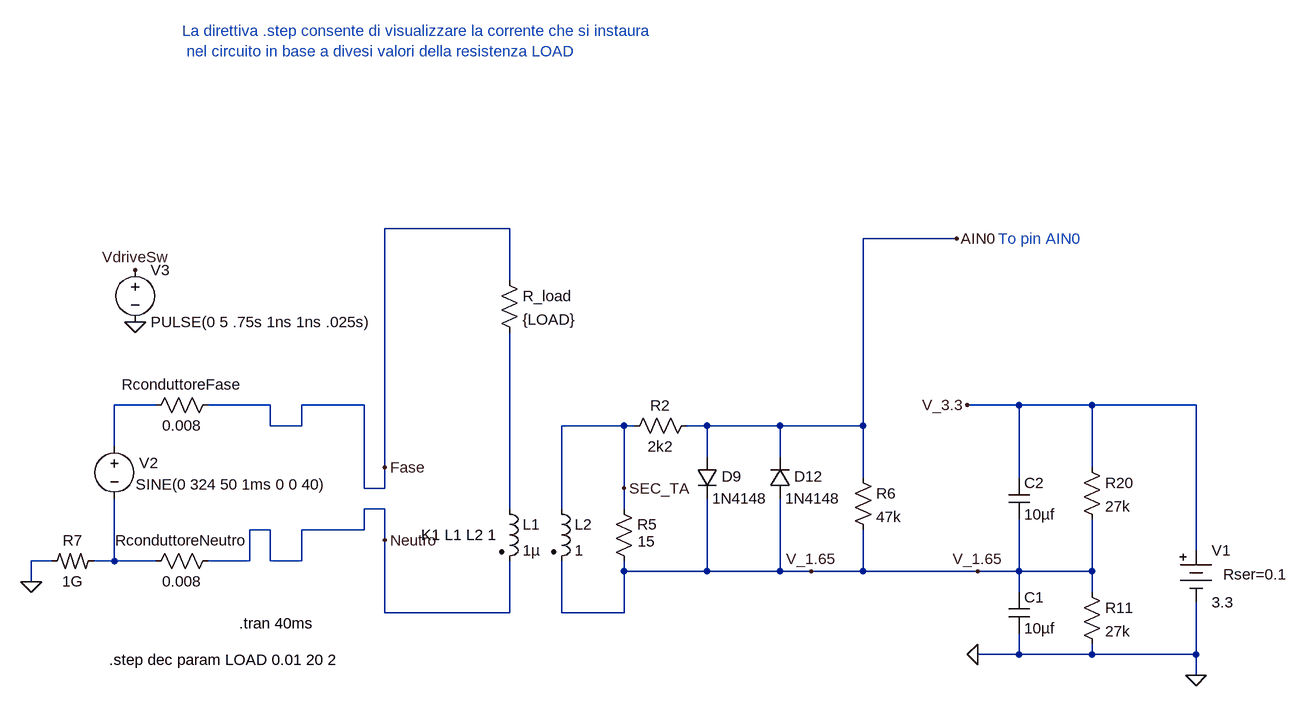
[diagram p0: schematic TrasfCurrentStudio2.asc]
TrasfCurrentStudio2.asc, the LTspice schematic file:
Version 4
SHEET 1 2288 680
WIRE 528 -464 336 -464
WIRE 1216 -448 1072 -448
WIRE 528 -384 528 -464
WIRE -16 -192 -80 -192
WIRE 160 -192 64 -192
WIRE 304 -192 208 -192
WIRE 1312 -192 1232 -192
WIRE 1424 -192 1312 -192
WIRE 1584 -192 1424 -192
WIRE 160 -160 160 -192
WIRE 208 -160 208 -192
WIRE 208 -160 160 -160
WIRE 704 -160 608 -160
WIRE 720 -160 704 -160
WIRE 832 -160 800 -160
WIRE 944 -160 832 -160
WIRE 1072 -160 1072 -448
WIRE 1072 -160 944 -160
WIRE -80 -128 -80 -192
WIRE 832 -112 832 -160
WIRE 944 -112 944 -160
WIRE 336 -96 336 -464
WIRE 1424 -96 1424 -192
WIRE 1072 -80 1072 -160
WIRE 1312 -80 1312 -192
WIRE 304 -64 304 -192
WIRE 336 -64 336 -96
WIRE 336 -64 304 -64
WIRE 704 -64 704 -160
WIRE 336 -32 304 -32
WIRE 528 -32 528 -304
WIRE 608 -32 608 -160
WIRE 704 -32 704 -64
WIRE 160 0 128 0
WIRE 304 0 304 -32
WIRE 304 0 208 0
WIRE 336 16 336 -32
WIRE 1584 32 1584 -192
WIRE -176 48 -208 48
WIRE -80 48 -80 -48
WIRE -80 48 -112 48
WIRE -16 48 -80 48
WIRE 128 48 128 0
WIRE 128 48 64 48
WIRE 160 48 160 0
WIRE 208 48 208 0
WIRE 208 48 160 48
WIRE 704 64 704 48
WIRE 832 64 832 -48
WIRE 832 64 704 64
WIRE 944 64 944 -48
WIRE 944 64 832 64
WIRE 992 64 944 64
WIRE 1072 64 1072 0
WIRE 1072 64 992 64
WIRE 1248 64 1072 64
WIRE 1312 64 1312 -16
WIRE 1312 64 1248 64
WIRE 1424 64 1424 -16
WIRE 1424 64 1312 64
WIRE -208 80 -208 48
WIRE 1312 96 1312 64
WIRE 1424 96 1424 64
WIRE 336 128 336 16
WIRE 528 128 528 48
WIRE 528 128 336 128
WIRE 608 128 608 48
WIRE 704 128 704 64
WIRE 704 128 608 128
WIRE 1312 192 1312 160
WIRE 1312 192 1248 192
WIRE 1424 192 1424 176
WIRE 1424 192 1312 192
WIRE 1584 192 1584 112
WIRE 1584 192 1424 192
WIRE 1584 224 1584 192
FLAG 1232 -192 V_3.3
FLAG -208 80 0
FLAG 1584 224 0
FLAG 1216 -448 AIN0
FLAG 1248 64 V_1.65
FLAG 992 64 V_1.65
FLAG 1248 192 0
FLAG -48 -400 VdriveSw
FLAG -48 -320 0
FLAG 336 -96 Fase
FLAG 336 16 Neutro
FLAG 704 -64 SEC_TA
SYMBOL battery 1584 16 R0
WINDOW 123 0 0 Left 0
WINDOW 39 42 53 Left 2
SYMATTR SpiceLine Rser=0.1
SYMATTR InstName V1
SYMATTR Value 3.3
SYMBOL res 688 -48 R0
WINDOW 3 37 66 Left 2
SYMATTR Value 15
SYMATTR InstName R5
SYMBOL ind2 512 -48 R0
SYMATTR InstName L1
SYMATTR Value 1µ
SYMATTR Type ind
SYMATTR SpiceLine Rser=1u
SYMBOL ind2 592 -48 R0
SYMATTR InstName L2
SYMATTR Value 1
SYMATTR Type ind
SYMATTR SpiceLine Rser=47 Cpar=1pF
SYMBOL res2 -112 32 R90
WINDOW 0 0 32 VBottom 2
WINDOW 3 32 32 VTop 2
SYMATTR InstName R7
SYMATTR Value 1G
SYMBOL res 1408 -112 R0
SYMATTR InstName R20
SYMATTR Value 27k
SYMBOL cap 1296 96 R0
SYMATTR InstName C1
SYMATTR Value 10µf
SYMBOL res 816 -176 R90
WINDOW 0 0 56 VBottom 2
WINDOW 3 32 56 VTop 2
SYMATTR InstName R2
SYMATTR Value 2k2
SYMBOL diode 816 -112 R0
WINDOW 0 38 30 Left 2
SYMATTR InstName D9
SYMATTR Value 1N4148
SYMBOL diode 928 -48 M180
WINDOW 0 38 34 Left 2
WINDOW 3 24 0 Left 2
SYMATTR InstName D12
SYMATTR Value 1N4148
SYMBOL res 1408 80 R0
SYMATTR InstName R11
SYMATTR Value 27k
SYMBOL voltage -80 -144 R0
WINDOW 123 0 0 Left 0
WINDOW 0 38 41 Left 2
WINDOW 3 33 74 Left 2
SYMATTR InstName V2
SYMATTR Value SINE(0 324 50 1ms 0 0 40)
SYMATTR SpiceLine Rser=0.01 Cpar=10nF
SYMBOL voltage -48 -416 R0
WINDOW 123 0 0 Left 0
WINDOW 39 0 0 Left 0
SYMATTR InstName V3
SYMATTR Value PULSE(0 5 .75s 1ns 1ns .025s)
SYMBOL res 80 -208 R90
WINDOW 0 0 56 VBottom 2
WINDOW 3 32 56 VTop 2
SYMATTR InstName RconduttoreFase
SYMATTR Value 0.008
SYMBOL res 80 32 R90
WINDOW 0 0 56 VBottom 2
WINDOW 3 32 56 VTop 2
SYMATTR InstName RconduttoreNeutro
SYMATTR Value 0.008
SYMBOL cap 1296 -80 R0
SYMATTR InstName C2
SYMATTR Value 10µf
SYMBOL res 512 -400 R0
SYMATTR InstName R_load
SYMATTR Value {LOAD}
SYMBOL res 1056 -96 R0
SYMATTR InstName R6
SYMATTR Value 47k
TEXT 112 144 Left 2 !.tran 40ms
TEXT 392 8 Left 2 !K1 L1 L2 1
TEXT -88 200 Left 2 !.step dec param LOAD 0.01 20 2
TEXT 1280 -448 Left 2 ;To pin AIN0
TEXT 24 -768 Left 2 ;La direttiva .step consente di visualizzare la corrente che si instaura\n nel circuito in base a divesi valori della resistenza LOAD

The netlist it stands for:
* TrasfCurrentStudio2.asc
V1 V_3.3 0 3.3 Rser=0.1
R5 SEC_TA V_1.65 15
L1 N002 Neutro 1µ Rser=1u
L2 SEC_TA V_1.65 1 Rser=47 Cpar=1pF
R7 N003 0 1G
R20 V_3.3 V_1.65 27k
C1 V_1.65 0 10µf
R2 AIN0 SEC_TA 2k2
D9 AIN0 V_1.65 1N4148
D12 V_1.65 AIN0 1N4148
R11 V_1.65 0 27k
V2 N001 N003 SINE(0 324 50 1ms 0 0 40) Rser=0.01 Cpar=10nF
V3 VdriveSw 0 PULSE(0 5 .75s 1ns 1ns .025s)
RconduttoreFase Fase N001 0.008
RconduttoreNeutro Neutro N003 0.008
C2 V_3.3 V_1.65 10µf
R_load Fase N002 {LOAD}
R6 AIN0 V_1.65 47k
.model D D
.lib standard.dio
.tran 40ms
K1 L1 L2 1
.step dec param LOAD 0.01 20 2
* To pin AIN0
* La direttiva .step consente di visualizzare la corrente che si instaura
*  nel circuito in base a divesi valori della resistenza LOAD
.backanno
.end

* Results of the author's LTspice run, read from the files saved beside the schematic
* Operating Point (first step), zero values left out:
*   load = 10 m
*   V(v_3.3) = 3.3 V
*   V(sec_ta) = 1.65 V
*   V(v_1.65) = 1.65 V
*   V(ain0) = 1.65 V
*   I(R11) = 61.11 µA
*   I(R20) = 61.11 µA
*   I(V1) = -61.11 µA
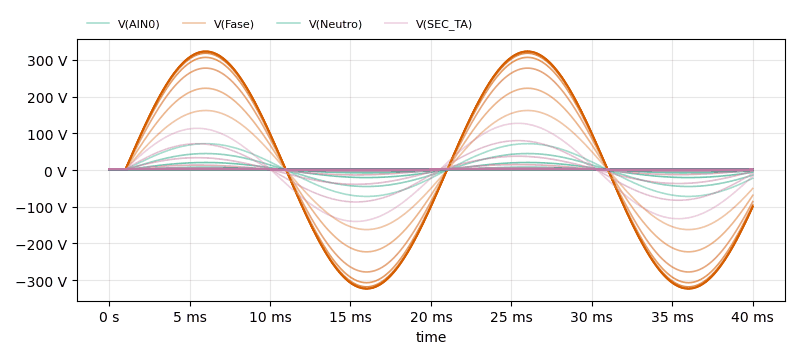
[diagram p1: Transient Analysis of TrasfCurrentStudio2.asc, plotted from the saved traces]
* Transient Analysis, 8 runs:
*   V(AIN0) [load=0.01]: min 840.9 mV, max 2.449 V, average 1.616 V, rms 1.781 V, last 968 mV
*   V(AIN0) [load=0.0316228]: min 876.1 mV, max 2.416 V, average 1.617 V, rms 1.77 V, last 992 mV
*   V(AIN0) [load=0.1]: min 924.3 mV, max 2.369 V, average 1.619 V, rms 1.755 V, last 1.032 V
*   V(AIN0) [load=0.316228]: min 977.5 mV, max 2.316 V, average 1.621 V, rms 1.736 V, last 1.089 V
*   V(AIN0) [load=1]: min 1.034 V, max 2.26 V, average 1.622 V, rms 1.715 V, last 1.188 V
*   V(AIN0) [load=3.16228]: min 1.1 V, max 2.192 V, average 1.622 V, rms 1.688 V, last 1.455 V
*   V(AIN0) [load=10]: min 1.224 V, max 2.049 V, average 1.623 V, rms 1.649 V, last 1.588 V
*   V(AIN0) [load=20]: min 1.406 V, max 1.867 V, average 1.634 V, rms 1.641 V, last 1.619 V
*   V(Fase) [load=0.01]: min -162.3 V, max 162.3 V, average 611.3 mV, rms 114.6 V, last -50.1 V
*   V(Fase) [load=0.0316228]: min -222.9 V, max 222.9 V, average 860.1 mV, rms 157.5 V, last -68.86 V
*   V(Fase) [load=0.1]: min -277.7 V, max 277.7 V, average 1.08 V, rms 196.2 V, last -85.82 V
*   V(Fase) [load=0.316228]: min -307 V, max 307 V, average 1.195 V, rms 216.9 V, last -94.86 V
*   V(Fase) [load=1]: min -318.3 V, max 318.3 V, average 1.24 V, rms 224.9 V, last -98.36 V
*   V(Fase) [load=3.16228]: min -322.2 V, max 322.2 V, average 1.255 V, rms 227.6 V, last -99.56 V
*   V(Fase) [load=10]: min -323.4 V, max 323.4 V, average 1.26 V, rms 228.5 V, last -99.94 V
*   V(Fase) [load=20]: min -323.7 V, max 323.7 V, average 1.261 V, rms 228.7 V, last -100 V
*   V(Neutro) [load=0.01]: min -71.88 V, max 71.9 V, average 289.1 mV, rms 50.79 V, last -22.23 V
*   V(Neutro) [load=0.0316228]: min -44.93 V, max 44.94 V, average 178.6 mV, rms 31.75 V, last -13.9 V
*   V(Neutro) [load=0.1]: min -20.56 V, max 20.57 V, average 80.93 mV, rms 14.53 V, last -6.357 V
*   V(Neutro) [load=0.316228]: min -7.576 V, max 7.577 V, average 29.57 mV, rms 5.352 V, last -2.34 V
*   V(Neutro) [load=1]: min -2.523 V, max 2.523 V, average 9.858 mV, rms 1.781 V, last -778.7 mV
*   V(Neutro) [load=3.16228]: min -823.7 mV, max 822.9 mV, average 3.178 mV, rms 579.5 mV, last -254.1 mV
*   V(Neutro) [load=10]: min -267.5 mV, max 266.1 mV, average 996.4 µV, rms 185.5 mV, last -82.43 mV
*   V(Neutro) [load=20]: min -133.4 mV, max 131.5 mV, average 556 µV, rms 91.28 mV, last -36.85 mV
*   V(SEC_TA) [load=0.01]: min -140.1 V, max 127.4 V, average -7.805 V, rms 90.81 V, last -16.35 V
*   V(SEC_TA) [load=0.0316228]: min -86.98 V, max 80.25 V, average -4.262 V, rms 56.72 V, last -9.591 V
*   V(SEC_TA) [load=0.1]: min -38.91 V, max 37.62 V, average -1.056 V, rms 25.9 V, last -3.491 V
*   V(SEC_TA) [load=0.316228]: min -13.29 V, max 14.9 V, average 653.2 mV, rms 9.556 V, last -244.5 mV
*   V(SEC_TA) [load=1]: min -3.337 V, max 6.073 V, average 1.317 V, rms 3.445 V, last 1.016 V
*   V(SEC_TA) [load=3.16228]: min 42.81 mV, max 3.076 V, average 1.543 V, rms 1.853 V, last 1.446 V
*   V(SEC_TA) [load=10]: min 1.137 V, max 2.105 V, average 1.616 V, rms 1.649 V, last 1.585 V
*   V(SEC_TA) [load=20]: min 1.393 V, max 1.878 V, average 1.633 V, rms 1.641 V, last 1.618 V